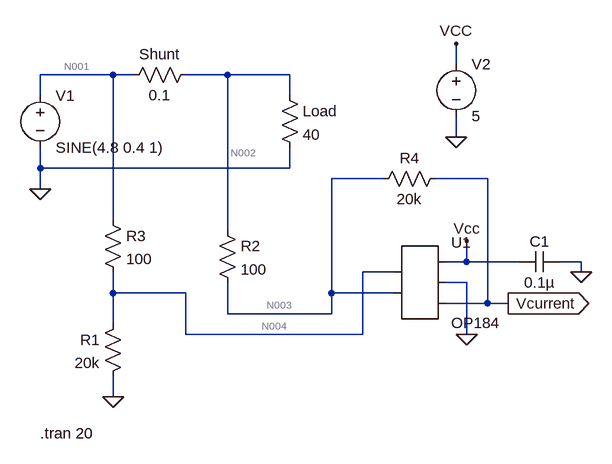
[diagram p0: schematic courantSinus.asc]
* courantSinus.asc
R§Shunt N002 N001 0.1
V1 N001 0 SINE(4.8 0.4 1)
R§Load N002 0 40
C1 0 Vcc 0.1µ
R1 N004 0 20k
R2 N002 N003 100
R3 N001 N004 100
R4 Vcurrent N003 20k
V2 Vcc 0 5
* U1: OP184 (symbol AutoGenerated\OP184 not available, pins judged from their places): pin1=N004 pin2=N003 pin3=Vcc pin4=0 pin5=Vcurrent
.tran 20
.backanno
.end

* Results of the author's LTspice run, read from the files saved beside the schematic
* Operating Point, zero values left out:
*   V(n002) = 4.788 V
*   V(n001) = 4.8 V
*   V(vcc) = 5 V
*   V(n004) = 4.776 V
*   V(n003) = 4.776 V
*   V(vcurrent) = 2.402 V
*   I(R4) = -118.7 µA
*   I(R3) = 239 µA
*   I(R2) = 118.9 µA
*   I(R1) = 238.8 µA
*   I(Load) = 119.7 mA
*   I(Shunt) = -119.8 mA
*   I(V2) = -831.9 µA
*   I(V1) = -120.1 mA
*   Ix(u1:1) = 203.6 nA
*   Ix(u1:2) = 213.6 nA
*   Ix(u1:99) = 831.9 µA
*   Ix(u1:50) = -951.1 µA
*   Ix(u1:45) = 118.7 µA
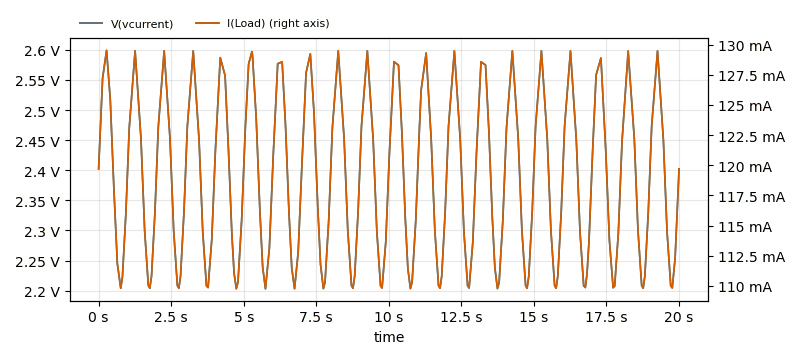
[diagram p1: Transient Analysis of courantSinus.asc, plotted from the saved traces]
* Transient Analysis, 1 run:
*   V(vcurrent): min 2.203 V, max 2.599 V, average 2.398 V, rms 2.402 V, last 2.402 V
*   I(Load): min 109.8 mA, max 129.5 mA, average 119.5 mA, rms 119.7 mA, last 119.7 mA